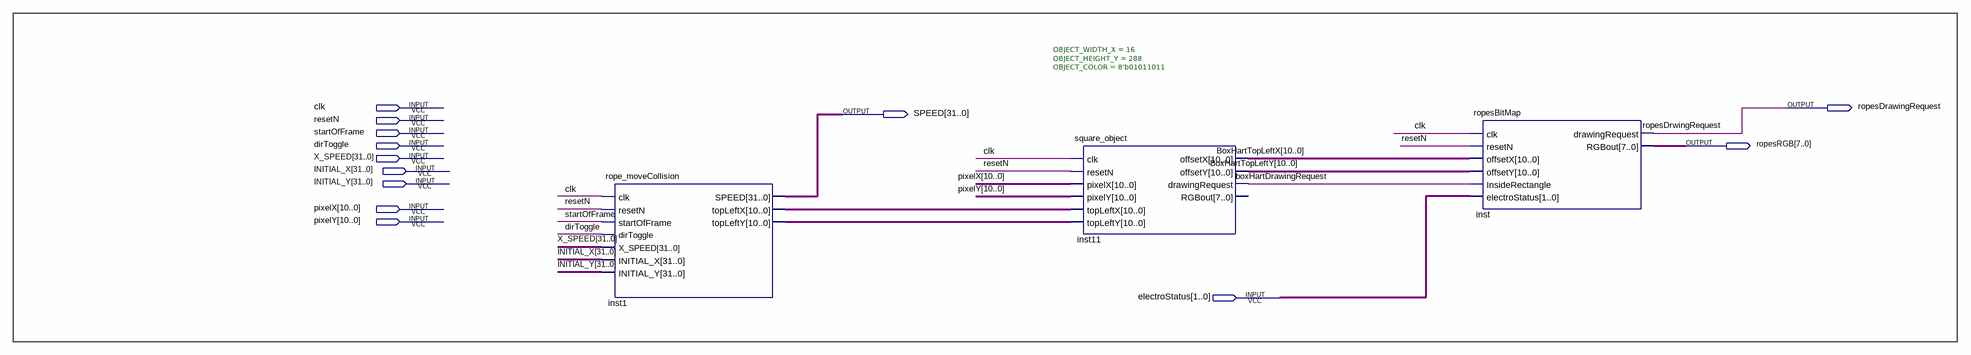
[diagram p0: schematic sheet]
// Quartus schematic SINGLE_ROPE_DISPLAY.bdf as structural Verilog: 3 symbols, 13 pins
module SINGLE_ROPE_DISPLAY (
  input  clk,
  input  resetN,
  input  startOfFrame,
  input  dirToggle,
  input  [31:0] X_SPEED,
  input  [31:0] INITIAL_X,
  input  [31:0] INITIAL_Y,
  input  [10:0] pixelX,
  input  [10:0] pixelY,
  input  [1:0] electroStatus,
  output ropesDrawingRequest,
  output [31:0] SPEED,
  output [7:0] ropesRGB
);

  wire boxHartDrawingRequest;
  wire [10:0] BoxHartTopLeftX, BoxHartTopLeftY, inst1_topleftx, inst1_toplefty;

  rope_moveCollision inst1 (
    .clk(clk), .resetN(resetN), .startOfFrame(startOfFrame), .dirToggle(dirToggle), .X_SPEED(X_SPEED),
    .INITIAL_X(INITIAL_X), .INITIAL_Y(INITIAL_Y), .SPEED(SPEED), .topLeftX(inst1_topleftx),
    .topLeftY(inst1_toplefty));
  square_object #(.OBJECT_WIDTH_X(16), .OBJECT_HEIGHT_Y(288), .OBJECT_COLOR(8'b01011011)) inst11 (
    .clk(clk), .resetN(resetN), .pixelX(pixelX), .pixelY(pixelY), .topLeftX(inst1_topleftx),
    .topLeftY(inst1_toplefty), .offsetX(BoxHartTopLeftX), .offsetY(BoxHartTopLeftY),
    .drawingRequest(boxHartDrawingRequest));  // open: RGBout
  ropesBitMap inst (
    .clk(clk), .resetN(resetN), .offsetX(BoxHartTopLeftX), .offsetY(BoxHartTopLeftY),
    .InsideRectangle(boxHartDrawingRequest), .electroStatus(electroStatus),
    .drawingRequest(ropesDrawingRequest), .RGBout(ropesRGB));

  // Other names for the same wires on the sheet: ropesDrwingRequest = ropesDrawingRequest
endmodule
